# Altium schematic sheet Thermo.SchDoc
size A4
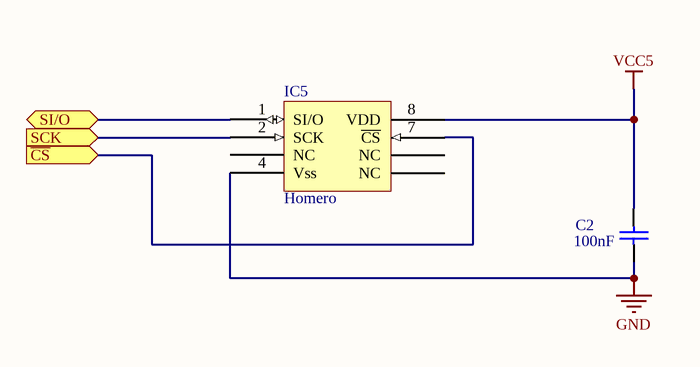
[diagram p0: Thermo.SchDoc]

## Parts
C2  100nF  [FP_0805_CAP_085]
IC5  Homero  [FP_SO8_MS012AA]

## Ports
SCK (in), SI/O (bidir), ~{CS} (in)

## Nets
GND: C2.1 IC5.4(Vss)
VCC5: C2.2 IC5.8(VDD)
~{CS}: IC5.7(~{CS}) ; port ~{CS}
SCK: IC5.2(SCK) ; port SCK
SI/O: IC5.1(SI/O) ; port SI/O

Not connected (* = marked no-connect by the designer): IC5 3(NC) 5(NC) 6(NC)

## Library data of the parts
C2 = CAP 100nF: Capacitor; Tolerance: +80%/-20%; Voltage: 25V; Reference: 1759167; Name: SMD Multilayer Ceramic Capacitor, 0805; Supplier: Farnell; Value: 100nF
IC5 = Homero: Name: Temperature Sensor IC; Reference: 1439514; Link: http://hu.farnell.com/microchip/tc77-5-0moa/sensor-thermal-13bit-spitm-smd/dp/1439514?ost=TC77-5.0MOA&selectedCategoryId=&categoryNameResp=%25C3%2596sszes&searchView=table&iscrfnonsku=false; Supplier: Farnell